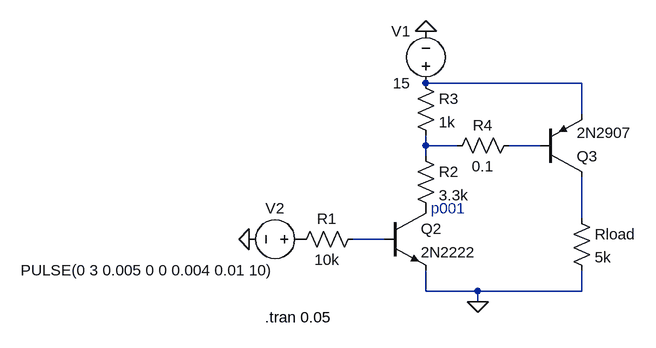
[diagram p0: schematic c02fig10.asc]
c02fig10.asc, the LTspice schematic file:
Version 4
SHEET 1 880 680
WIRE 432 16 192 16
WIRE 432 64 432 16
WIRE 192 112 192 96
WIRE 240 112 192 112
WIRE 368 112 320 112
WIRE 192 128 192 112
WIRE 432 224 432 160
WIRE 128 256 80 256
WIRE 192 336 192 304
WIRE 272 336 192 336
WIRE 432 336 432 304
WIRE 432 336 272 336
WIRE 272 352 272 336
FLAG 192 -64 0
FLAG 272 352 0
FLAG -80 256 0
SYMBOL pnp 368 160 M180
SYMATTR InstName Q3
SYMATTR Value 2N2907
SYMBOL npn 128 208 R0
SYMATTR InstName Q2
SYMATTR Value 2N2222
SYMBOL voltage 192 32 R180
WINDOW 0 24 96 Left 2
WINDOW 3 24 16 Left 2
WINDOW 123 0 0 Left 0
WINDOW 39 0 0 Left 0
SYMATTR InstName V1
SYMATTR Value 15
SYMBOL res 176 0 R0
SYMATTR InstName R3
SYMATTR Value 1k
SYMBOL res 176 112 R0
SYMATTR InstName R2
SYMATTR Value 3.3k
SYMBOL res 416 208 R0
SYMATTR InstName Rload
SYMATTR Value 5k
SYMBOL res 96 240 R90
WINDOW 0 0 56 VBottom 2
WINDOW 3 32 56 VTop 2
SYMATTR InstName R1
SYMATTR Value 10k
SYMBOL res 336 96 R90
WINDOW 0 0 56 VBottom 2
WINDOW 3 32 56 VTop 2
SYMATTR InstName R4
SYMATTR Value 0.1
SYMBOL voltage 16 256 R90
WINDOW 0 -32 56 VBottom 2
WINDOW 3 32 252 VTop 2
WINDOW 123 0 0 Left 0
WINDOW 39 0 0 Left 0
SYMATTR InstName V2
SYMATTR Value PULSE(0 3 0.005 0 0 0.004 0.01 10)
TEXT -56 376 Left 2 !.tran 0.05
TEXT 200 208 Left 2 ;p001

The netlist it stands for:
* c02fig10.asc
Q3 N004 N003 N001 0 2N2907
Q2 P001 N005 0 0 2N2222
V1 N001 0 15
R3 N001 N002 1k
R2 N002 P001 3.3k
Rload N004 0 5k
R1 N005 P002 10k
R4 N003 N002 0.1
V2 P002 0 PULSE(0 3 0.005 0 0 0.004 0.01 10)
.model NPN NPN
.model PNP PNP
.lib standard.bjt
.tran 0.05
* p001
.backanno
.end